# EAGLE design DOG_DisplayBreakout_pth+smd (EAGLE 7.3.0)
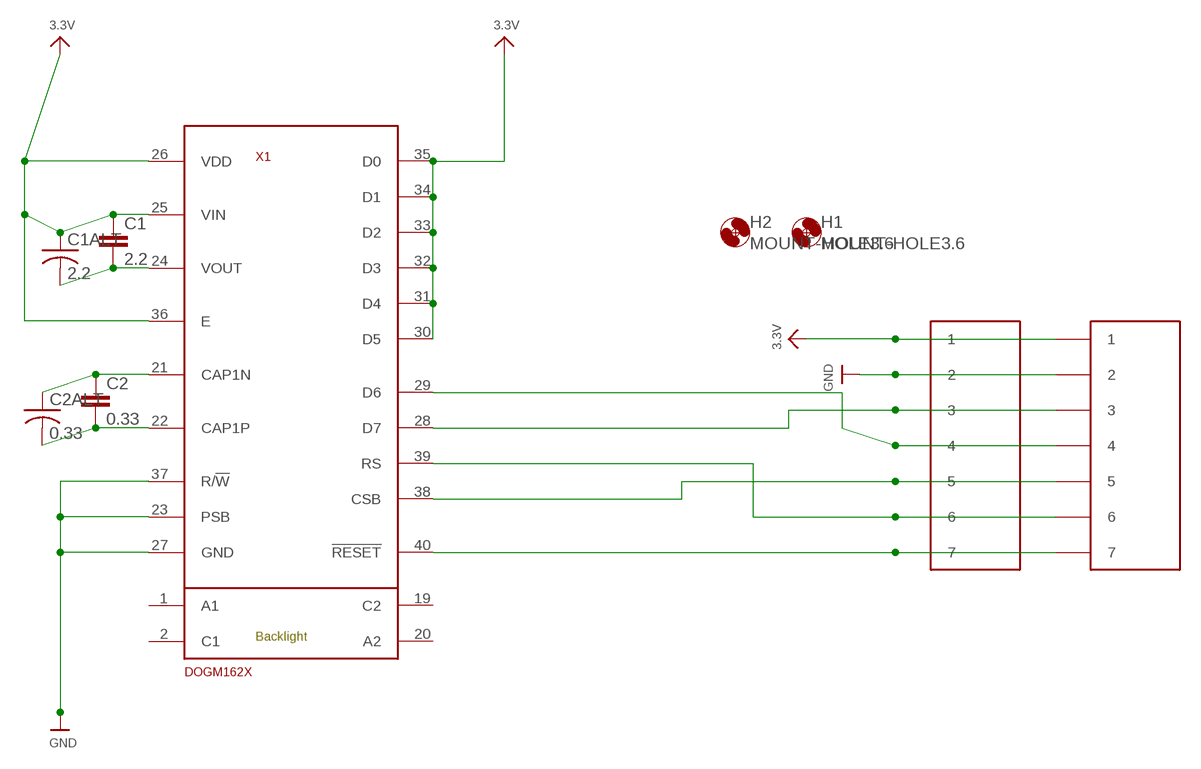
[diagram p0: schematic, sheet 1]

## Parts
C1  2.2  CAPACITOR0805  [0805_BIGGERPAD-OK]
C1ALT  2.2  C-US050-035X075  [C050-035X075]
C2  0.33  CAPACITOR0805  [0805_BIGGERPAD-OK]
C2ALT  0.33  C-US050-024X044  [C050-024X044]
CN1  JST_S7B-PH-SM4-TB  [JST_S7B-PH-SM4-TB]
CN1ALT  JST_S7B-PH-K-S  [JST_S7B-PH-K-S]
H1  MOUNT-HOLE3.6  [HOLE3,6]
H2  MOUNT-HOLE3.6  [HOLE3,6]
X1  DOGM162X  [DOGM162X]

## Nets
3.3V: C1.1 C1ALT.1 CN1.P$1 CN1ALT.P1 X1.25(VIN) X1.26(VDD) X1.30(D5) X1.31(D4) X1.32(D3) X1.33(D2) X1.34(D1) X1.35(D0) X1.36(E)
CLK: CN1.P$4 CN1ALT.P4 X1.29(D6)
CSB: CN1.P$5 CN1ALT.P5 X1.38(CSB)
GND: CN1.P$2 CN1ALT.P2 X1.23(PSB) X1.27(GND) X1.37(R/!W)
N$1: C1.2 C1ALT.2 X1.24(VOUT)
N$2: C2.1 C2ALT.1 X1.21(CAP1N)
N$3: C2.2 C2ALT.2 X1.22(CAP1P)
N$4: CN1.P$7 CN1ALT.P7 X1.40(!RESET)
N$5: CN1.P$3 CN1ALT.P3 X1.28(D7)
RS: CN1.P$6 CN1ALT.P6 X1.39(RS)
Unconnected: X1.1(A1) X1.2(C1) X1.19(C2) X1.20(A2)

## Library data of the parts
C1 C2 = DMF-Bigger_SMD_footprints:CAPACITOR: Capacitor Standard 0603 ceramic capacitor, and 0.1" leaded capacitor.
C1ALT = rcl:C-US: CAPACITOR, American symbol
C2ALT = adafruit:C-US: CAPACITOR, American symbol
CN1 = DMF-Additional_Supply_dmf:JST_S7B-PH-SM4-TB
CN1ALT = DMF-Additional_Supply_dmf:JST_S7B-PH-K-S
H1 H2 = DMF-Audio_Connectors:MOUNT-HOLE: MOUNTING HOLE with drill center marker
X1 = DMF_Displays:DOGM162X: DOGM Character Display http://www.lcd-module.com/products/dog.html

## Board
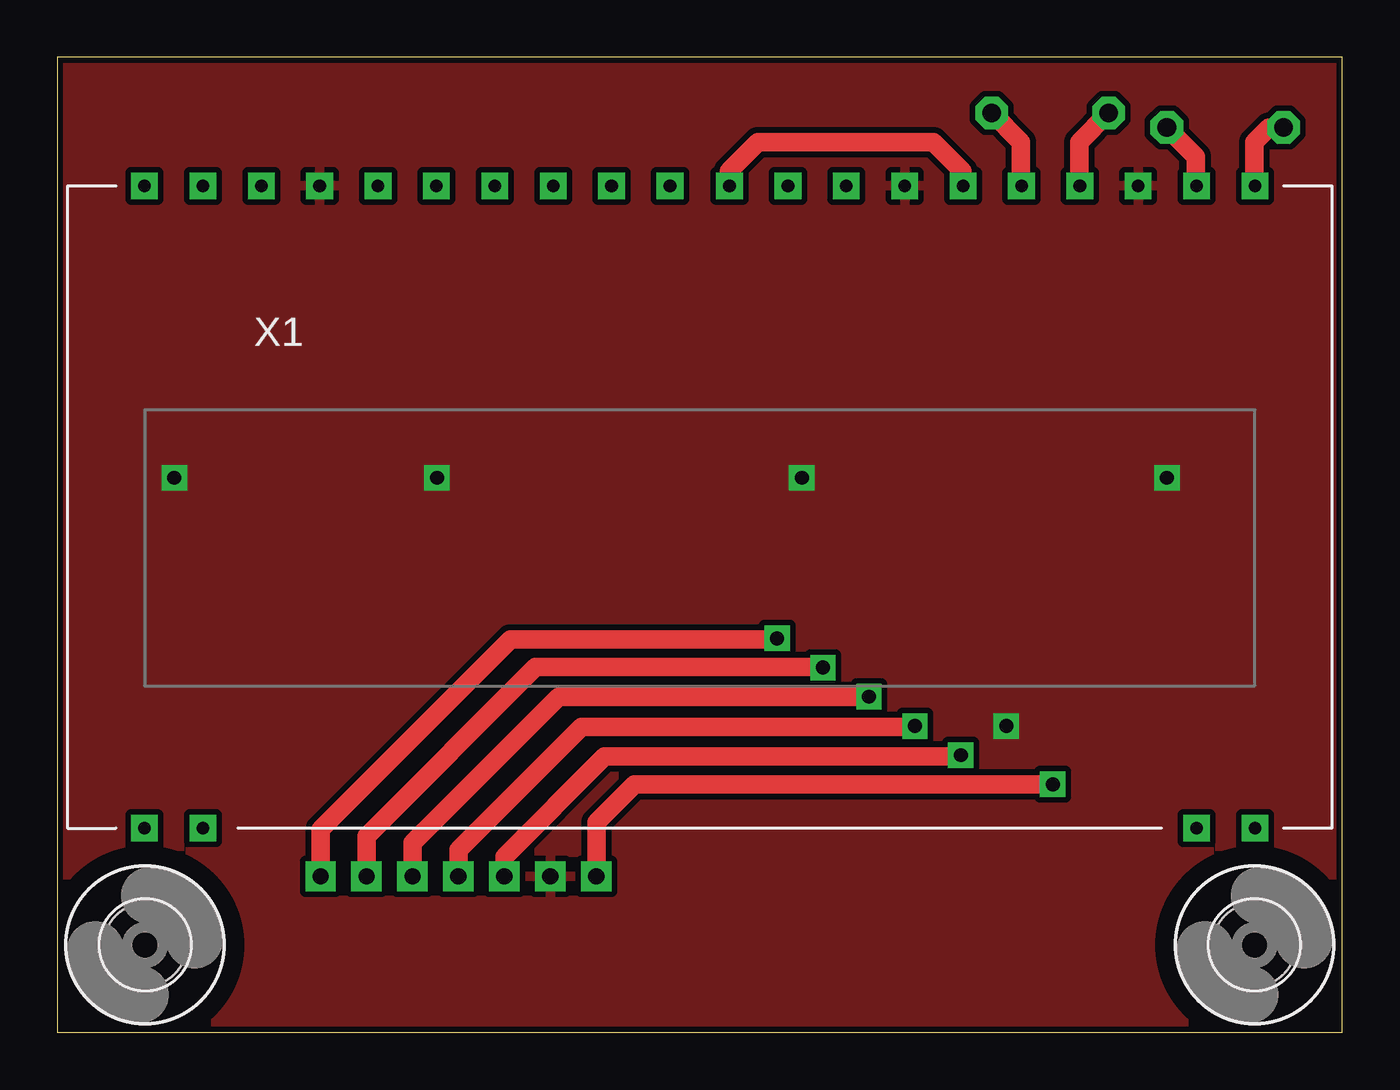
[diagram p1: board, top side]
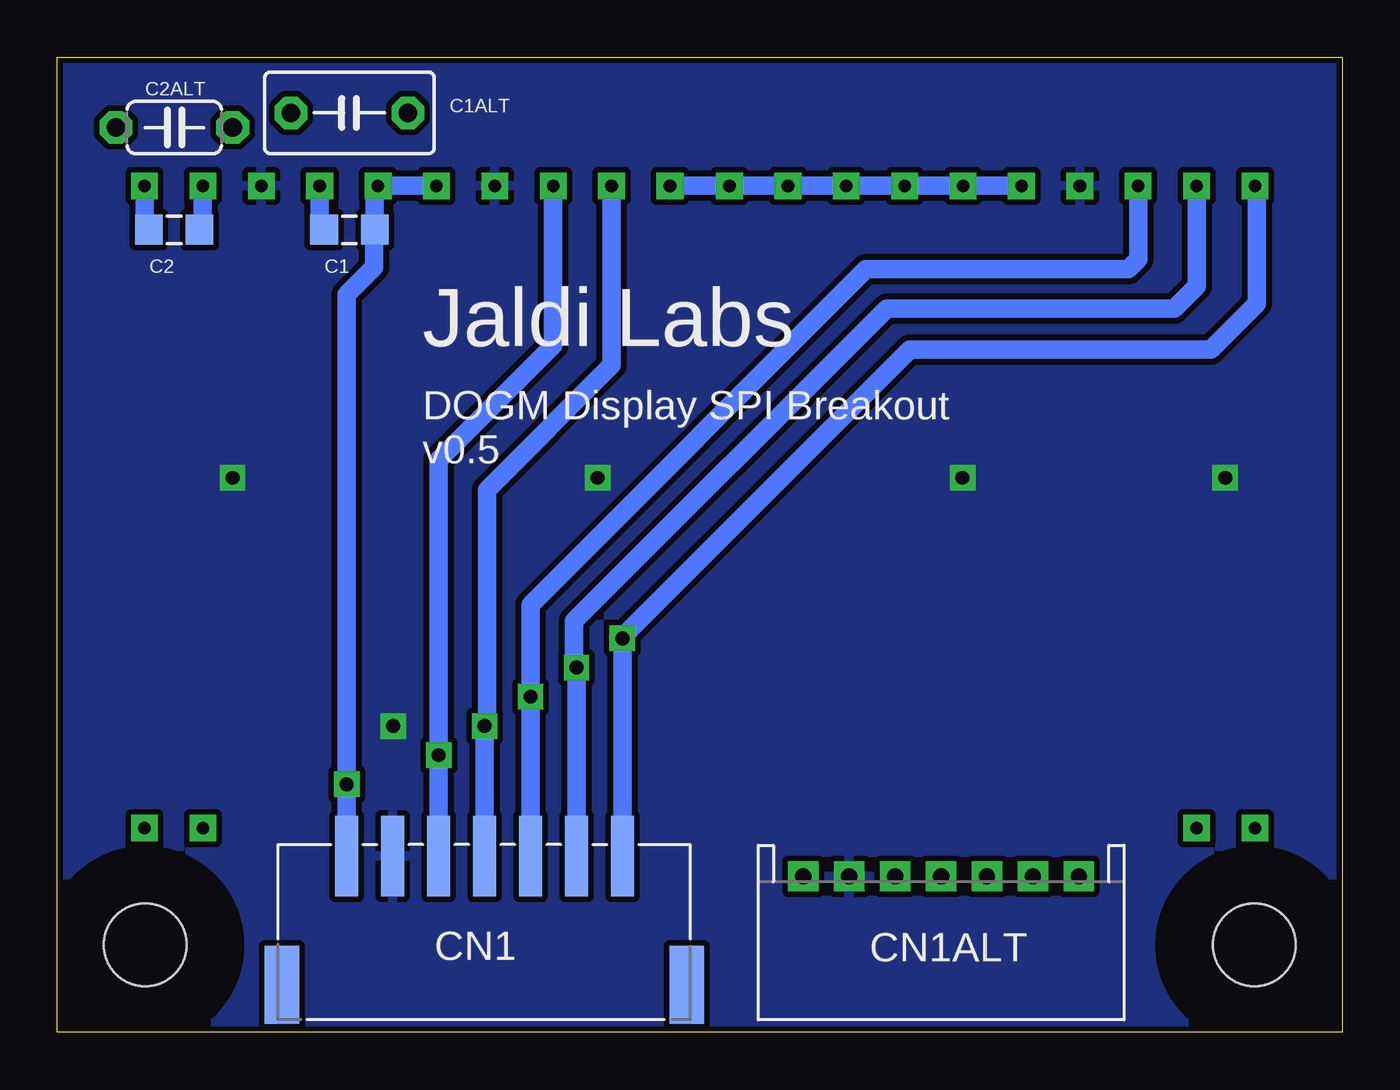
[diagram p2: board, bottom side, seen from below]

Size 55.88 x 42.42 mm. Coordinates in mm from the lower left corner, seen from the top.
Outline: 0,0 55.88,0 55.88,42.42 0,42.42 0,0
Copper layers (1*16): Top 0.035mm / dielectric 1.5mm / Bottom 0.035mm
Design rules "SparkFun-2-layer": minimum track width 7mil, minimum drill 15mil, track to track 8mil, track to pad 8mil, pad to pad 8mil, via to via 8mil, smd to smd 8mil, copper to edge 8mil, drill to drill 8mil, minimum pad ring 12mil, minimum via ring 10mil, stop-mask expansion 4mil, vias tented up to drill 20mil, thermal gap 10mil

### Footprints (pad centres in the part's own frame; a part is rotated, then mirrored left to right if it is on the bottom)
0805_BIGGERPAD-OK = smd 1.2 x 1.3: 1 -1.1,0; 2 1.1,0
C050-035X075 = drill 0.813 octagon: 1 -2.54,0; 2 2.54,0
C050-024X044 = drill 0.813 octagon: 1 -2.54,0; 2 2.54,0
JST_S7B-PH-SM4-TB = smd 1 x 3.5: P$1 3.68,7.42; P$2 5.68,7.42; P$3 7.68,7.42; P$4 9.68,7.42; P$5 11.68,7.42; P$6 13.68,7.42; P$7 15.68,7.42 | smd 1.5 x 3.4: S1 18.48,1.82; S2 0.88,1.82
JST_S7B-PH-K-S = drill 0.7 square: P1 1.96,6.24; P2 3.96,6.24; P3 5.96,6.24; P4 7.96,6.24; P5 9.96,6.24; P6 11.96,6.24; P7 13.96,6.24
HOLE3,6 = hole 3.6: 0,0
DOGM162X = drill 0.55 square: 1 -24.155,-13.97; 2 -21.615,-13.97; 19 21.615,-13.97; 20 24.155,-13.97; 21 24.155,13.97; 22 21.615,13.97; 23 19.075,13.97; 24 16.535,13.97; 25 13.995,13.97; 26 11.455,13.97; 27 8.915,13.97; 28 6.375,13.97; 29 3.835,13.97; 30 1.295,13.97; 31 -1.295,13.97; 32 -3.835,13.97; 33 -6.375,13.97; 34 -8.915,13.97; 35 -11.455,13.97; 36 -13.995,13.97; 37 -16.535,13.97; 38 -19.075,13.97; 39 -21.615,13.97; 40 -24.155,13.97

### Placement (x,y rotation side)
C1  43.18,34.92 180 bottom
C1ALT  43.18,40.01 180 bottom
C2  50.8,34.92 0 bottom
C2ALT  50.8,39.37 0 bottom
CN1  46.99,0.25 0 bottom
CN1ALT  25.4,0.56 0 bottom
H1  3.81,3.81 0 top
H2  52.07,3.81 0 top
X1  27.94,22.86 0 top

### Tracks (layer width: path | path; a pad name or v marks a point on that pad's centre or on a via)
3.3V  (via drill 0.6)
  Top 0.813: X1.26 39.37,36.8 39.37,37.47 38.1,38.73 30.48,38.73 29.21,37.47 29.21,36.85 X1.30 | 42.08,36.69 X1.25 41.91,36.85 41.91,38.73 C1ALT.1 | CN1ALT.P1 23.44,9.14 25.1,10.8 v43.3,10.8 v43.3,10.79
  Bottom 0.813: X1.30 X1.31 X1.32 X1.33 X1.34 X1.35 X1.36 | CN1.P$1 43.31,10.69 43.3,10.7 v43.3,10.79 43.3,32.1 42.1,33.3 42.1,34.91 C1.1 42.08,36.69 X1.25 X1.26
CLK  (via drill 0.6)
  Top 0.813: v37.3,13.34 37.27,13.3 22.8,13.3 17.44,7.94 CN1ALT.P4
  Bottom 0.813: CN1.P$4 37.31,13.32 v37.3,13.34 37.2,13.44 37.2,23.6 31.77,29.02 X1.29
CSB  (via drill 0.6)
  Top 0.813: v35.3,14.61 v35.3,14.6 21.8,14.6 15.44,8.24 CN1ALT.P5
  Bottom 0.813: CN1.P$5 35.31,14.6 v35.3,14.61 | 35.2,14.71 v35.3,14.61 | X1.38 8.87,33.63 9.3,33.2 20.7,33.2 35.3,18.6 v35.3,14.61
GND  (via drill 0.6)
  other vias: 5.08,24.13 48.26,24.13 16.51,24.13 32.38,24.13 41.27,13.34
  pour Bottom (isolate 0.254): -1.91,44.45 59.69,43.81 59.69,-2.54 -2.54,-2.54
  pour Top (isolate 0.254): -2.54,45.09 59.05,43.81 58.42,-1.91 -2.54,-2.54
N$1
  Top 0.813: C1ALT.2 44.45,38.73 44.45,36.85 X1.24
  Bottom 0.813: X1.24 44.48,35.12 C1.2
N$2
  Top 0.813: C2ALT.1 52.7,39.37 52.07,38.73 52.07,36.85 X1.21
  Bottom 0.813: X1.21 52.09,35.12 C2.1
N$3
  Top 0.813: C2ALT.2 49.53,38.1 49.53,36.85 X1.22
  Bottom 0.813: X1.22 49.55,35.07 C2.2
N$4  (via drill 0.6)
  Top 0.813: v31.3,17.14 31.25,17.1 19.7,17.1 11.44,8.84 CN1ALT.P7
  Bottom 0.813: CN1.P$7 v31.31,17.14 v31.3,17.14 | 31.2,17.25 v31.3,17.14 | 3.79,36.81 X1.40 3.7,36.74 3.7,31.7 5.7,29.7 18.8,29.7 31.3,17.2 v31.3,17.14
N$5  (via drill 0.6)
  Top 0.813: v39.3,12.06 39.23,12 23.8,12 19.44,7.64 CN1ALT.P3
  Bottom 0.813: CN1.P$3 v39.31,12.05 v39.3,12.06 39.3,24.9 34.31,29.89 X1.28
RS  (via drill 0.6)
  Top 0.813: v33.3,15.88 33.27,15.9 20.8,15.9 13.44,8.54 CN1ALT.P6
  Bottom 0.813: CN1.P$6 33.31,15.87 v33.3,15.88 | 33.2,15.97 v33.3,15.88 | X1.39 6.33,32.48 7.3,31.5 19.8,31.5 33.4,17.9 33.4,15.97 v33.3,15.88

### Text on the board
bNames: Jaldi Labs | DOGM Display SPI Breakout / v0.5